# Altium project PowerMeter.PrjPcb
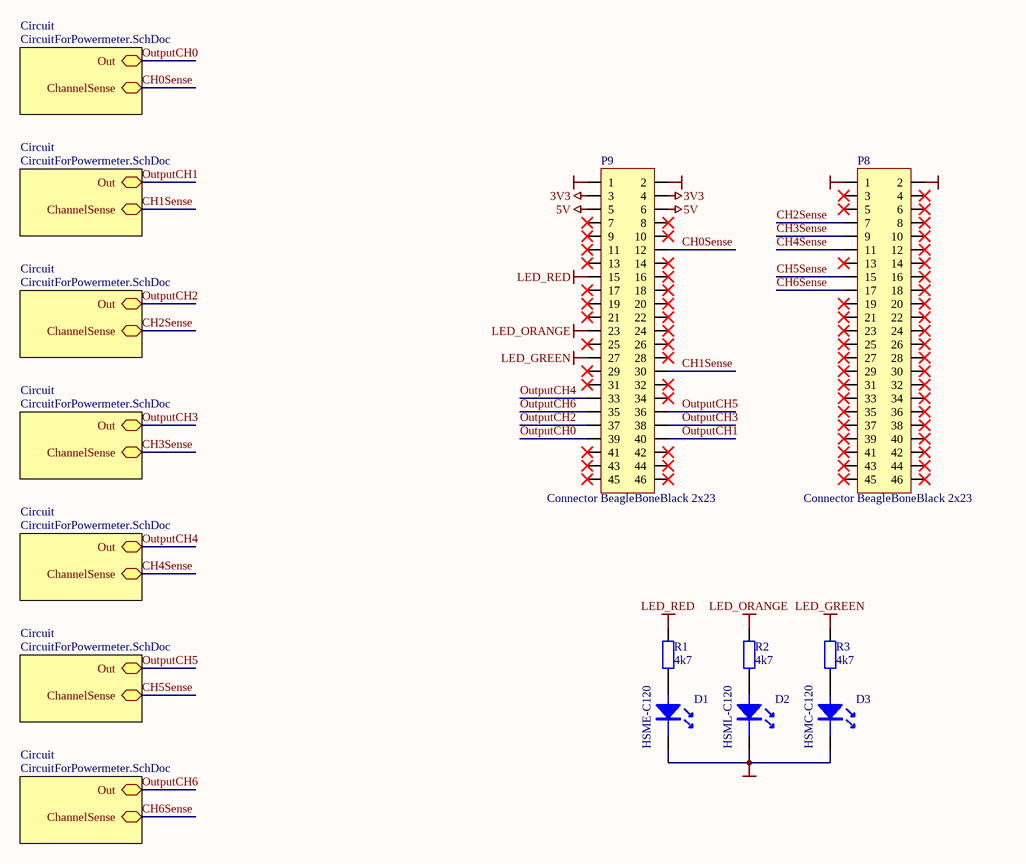
[diagram p0: BeagleBoneBlackPowerMeterCap.SchDoc]
2 sheets, 113 parts. Net scope: hierarchical (ports join the sheet entries above them; power ports are global).
Board file: PowerMeterCap.PcbDoc
Sheets:
  BeagleBoneBlackPowerMeterCap.SchDoc
    Circuit = CircuitForPowermeter.SchDoc
    Circuit = CircuitForPowermeter.SchDoc
    Circuit = CircuitForPowermeter.SchDoc
    Circuit = CircuitForPowermeter.SchDoc
    Circuit = CircuitForPowermeter.SchDoc
    Circuit = CircuitForPowermeter.SchDoc
    Circuit = CircuitForPowermeter.SchDoc

## Sheet BeagleBoneBlackPowerMeterCap.SchDoc: PowerMeterCapForBeagleBone
size A4; Date: 22.06.2020; CompanyName: -; DrawnBy: Baris; DocumentNumber: 69; Revision: 1.1; SheetNumber: 1; SheetTotal: 1; CurrentTime: 22.06.2020

### Parts
D1  HSME-C120  [AVAGO_HSMx-C120]
D2  HSML-C120  [AVAGO_HSMx-C120]
D3  HSMC-C120  [AVAGO_HSMx-C120]
P8  Connector BeagleBoneBlack 2x23  [Connector_BeagleBoneBlack_2x23]
P9  Connector BeagleBoneBlack 2x23  [Connector_BeagleBoneBlack_2x23]
R1  4k7  [0805_R]
R2  4k7  [0805_R]
R3  4k7  [0805_R]

### Sub-sheets
Circuit = CircuitForPowermeter.SchDoc: Out, ChannelSense
Circuit = CircuitForPowermeter.SchDoc: Out, ChannelSense
Circuit = CircuitForPowermeter.SchDoc: Out, ChannelSense
Circuit = CircuitForPowermeter.SchDoc: Out, ChannelSense
Circuit = CircuitForPowermeter.SchDoc: Out, ChannelSense
Circuit = CircuitForPowermeter.SchDoc: Out, ChannelSense
Circuit = CircuitForPowermeter.SchDoc: Out, ChannelSense

### Nets
3V3: P9.3 P9.4
5V: P9.5 P9.6
LED_GREEN: P9.27 R3.2
LED_ORANGE: P9.23 R2.2
LED_RED: P9.15 R1.2
NetC1_Circuit#1_2: D1.C D2.C D3.C P8.1 P8.2 P9.1 P9.2
CH0Sense: P9.12 ; sheet Circuit/ChannelSense
CH1Sense: P9.30 ; sheet Circuit/ChannelSense
CH2Sense: P8.7 ; sheet Circuit/ChannelSense
CH3Sense: P8.9 ; sheet Circuit/ChannelSense
CH4Sense: P8.11 ; sheet Circuit/ChannelSense
CH5Sense: P8.15 ; sheet Circuit/ChannelSense
CH6Sense: P8.17 ; sheet Circuit/ChannelSense
OutputCH0: P9.39 ; sheet Circuit/Out
OutputCH1: P9.40 ; sheet Circuit/Out
OutputCH2: P9.37 ; sheet Circuit/Out
OutputCH3: P9.38 ; sheet Circuit/Out
OutputCH4: P9.33 ; sheet Circuit/Out
OutputCH5: P9.36 ; sheet Circuit/Out
OutputCH6: P9.35 ; sheet Circuit/Out
NetD1_A: D1.A R1.1
NetD2_A: D2.A R2.1
NetD3_A: D3.A R3.1

Not connected (* = marked no-connect by the designer): P8 3* 4* 5* 6* 8* 10* 12* 13* 14* 16* 18* 19* 20* 21* 22* 23* 24* 25* 26* 27* 28* 29* 30* 31* 32* 33* 34* 35* 36* 37* 38* 39* 40* 41* 42* 43* 44* 45* 46*; P9 7* 8* 9* 10* 11* 13* 14* 16* 17* 18* 19* 20* 21* 22* 24* 25* 26* 28* 29* 31* 32* 34* 41* 42* 43* 44* 45* 46*

### Notes on the sheet
- Title:
- Number:
- Drawn by:
- Revision:
- Date:
- Sheet
- of
- File:

### Library data of the parts
D1 = HSME-C120: LED right angle green; Hersteller: BROADCOM; Art-Nummer: P300 326; Bestell-Bezeichnung: HSME-C120
D2 = HSML-C120: LED right angle orange; Hersteller: BROADCOM; Art-Nummer: P300 325; Bestell-Bezeichnung: HSML-C120
D3 = HSMC-C120: LED right angle red; Hersteller: BROADCOM; Art-Nummer: P300 324; Bestell-Bezeichnung: HSMC-C120
P8 P9 = J_Connector_BeagleBoneBlack_2x23: 23pin dual row header
R1-R3 = R: Resistor; Value: 4k7; Power Rating: *; Tolerance: *; Manufacturer 1: *; Manufacturer 1 Part No.: *; Distributor 1: *; Distributor 1 Part No.: *

## Sheet CircuitForPowermeter.SchDoc: CircuitForPowerMeter
size A4; Date: 19.06.2020; DrawnBy: Baris; Organization: espros photonics AG; Address1: St. Gallerstrasse 135; Address2: 7320 Sargans; Address3: Switzerland; DocumentNumber: 69; Revision: V1.1; SheetNumber: 1; SheetTotal: 1
Used 7 times, as channels Circuit, Circuit, Circuit, Circuit, Circuit, Circuit, Circuit. Parts and nets are listed once, with the designators drawn on the sheet.
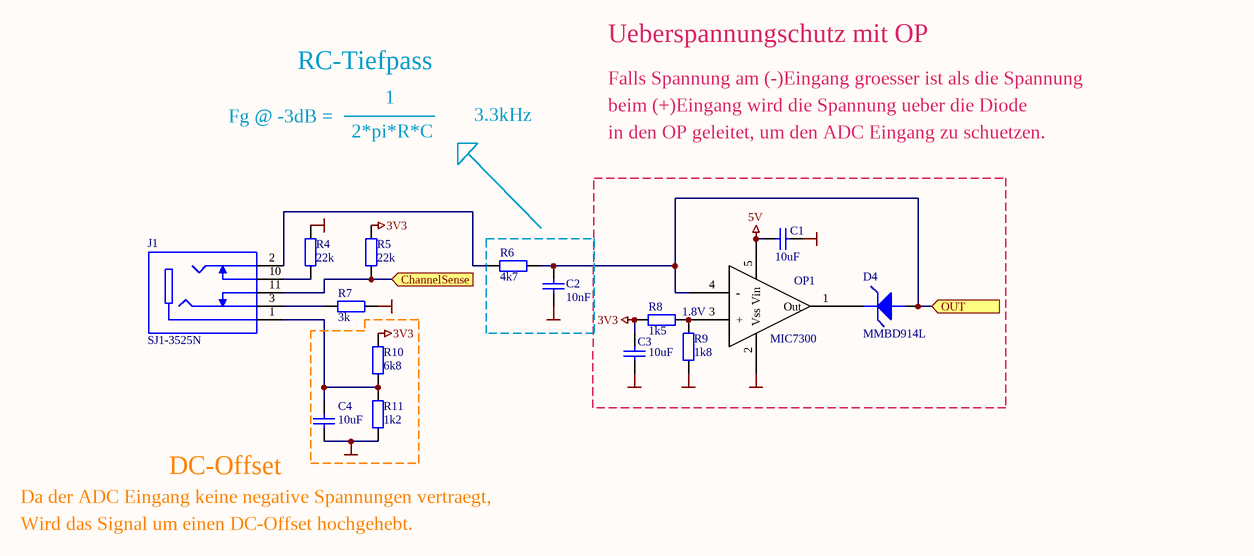
[diagram p1: CircuitForPowermeter.SchDoc]

### Parts
C1  10uF  [1206_C]
C2  10nF  [0805]
C3  10uF  [1206_C]
C4  10uF  [1206_C]
D4  MMBD914L  [SOT-23]
J1  SJ1-3525N  [CUI_SJ1-3525N]
OP1  MIC7300  [SOT-23-5]
R4  22k  [0805_R]
R5  22k  [0805_R]
R6  4k7  [0805_R]
R7  3k  [0805_R]
R8  1k5  [0805_R]
R9  1k8  [0805_R]
R10  6k8  [0805_R]
R11  1k2  [0805_R]

### Blocks framed on the sheet
1.8V: C1 C3 D4 OP1 R8 R9

### Ports
ChannelSense (in), OUT (in)

### Nets
3V3: C3.2 R5.1 R8.1 R10.2
5V: C1.1 OP1.5(Vin)
NetC1_2: C1.2 C2.1 C3.1 C4.1 OP1.2(Vss) R4.1 R7.1 R9.1 R11.1
ChannelSense: J1.11 R5.2 ; port ChannelSense
OUT: C2.2 D4.1(A) OP1.4(-) R6.2 ; port OUT
NetC4_2: C4.2 J1.1 R10.1 R11.2
NetD4_3: D4.3(K) OP1.1(Out)
NetJ1_2: J1.2 R6.1
NetJ1_3: J1.3 R7.2
NetJ1_10: J1.10 R4.2
NetOP1_3: OP1.3(+) R8.2 R9.2

Not connected (* = marked no-connect by the designer): D4 2(NC)

### Channels
Circuit: designators end in _Circuit#1; ports ChannelSense=CH0Sense OUT=OutputCH0
Circuit: designators end in _Circuit#2; ports ChannelSense=CH1Sense OUT=OutputCH1
Circuit: designators end in _Circuit#3; ports ChannelSense=CH2Sense OUT=OutputCH2
Circuit: designators end in _Circuit#4; ports ChannelSense=CH3Sense OUT=OutputCH3
Circuit: designators end in _Circuit#5; ports ChannelSense=CH4Sense OUT=OutputCH4
Circuit: designators end in _Circuit#6; ports ChannelSense=CH5Sense OUT=OutputCH5
Circuit: designators end in _Circuit#7; ports ChannelSense=CH6Sense OUT=OutputCH6

### Notes on the sheet
- RC-Tiefpass
- Ueberspannungschutz mit OP
- Falls Spannung am (-)Eingang groesser ist als die Spannung
- Fg @ -3dB =
- 2*pi*R*C
- 1
- 3.3kHz
- beim (+)Eingang wird die Spannung ueber die Diode
- in den OP geleitet, um den ADC Eingang zu schuetzen.
- (near C4) DC-Offset
- Da der ADC Eingang keine negative Spannungen vertraegt,
- Wird das Signal um einen DC-Offset hochgehebt.
- Title:
- Number:
- Drawn by:
- Revision:
- Date:
- Sheet
- of
- File:

### Library data of the parts
C1-C4 = C: Capacitor; Tolerance: *; Voltage Rating: *; Ceramic: *; Manufacturer 1: *; Manufacturer 1 Part No.: *; Distributor 1: *; Distributor 1 Part No.: *
  C1 C3 C4: Value: 10uF
  C2: Value: 10nF
D4 = BZX84-B10: High-Speed Switching  Diode; Art-Nummer: No; Hersteller: MMBD914L; Bestell-Bezeichnung: MMBD914L
J1 = SJ1-3525N: 3.5 mm, Stereo, Right Angle, Through Hole, Audio Jack Connector; MF: CUI Devices; Package: None; Price: None; Availability: Unavailable; MP: SJ1-3525N; CUI_purchase_URL: https://www.cuidevices.com/product/interconnect/connectors/audio-connectors/jacks/sj1-352xn-series?utm_source=snapeda.com&utm_medium=referral&utm_campaign=snapedaBOM; SnapEDA_Link: https://www.snapeda.com/parts/SJ1-3525N/CUI%20Devices/view-part/231506/?ref=snap; Value: *
OP1 = Component_1
R4 R5 = R: Resistor; Value: 15k; Power Rating: *; Tolerance: *; Manufacturer 1: *; Manufacturer 1 Part No.: *; Distributor 1: *; Distributor 1 Part No.: *
R6-R11 = R: Resistor; Power Rating: *; Tolerance: *; Manufacturer 1: *; Manufacturer 1 Part No.: *; Distributor 1: *; Distributor 1 Part No.: *
  R6: Value: 4k7
  R7: Value: 3k
  R8: Value: 1k5
  R9: Value: 1k8
  R10: Value: 6k8
  R11: Value: 1k2

## Nets that join several sheets
3V3: BeagleBoneBlackPowerMeterCap (P9.3 P9.4), Circuit (C3_Circuit#1.2 R5_Circuit#1.1 R8_Circuit#1.1 R10_Circuit#1.2), Circuit (C3_Circuit#2.2 R5_Circuit#2.1 R8_Circuit#2.1 R10_Circuit#2.2), Circuit (C3_Circuit#3.2 R5_Circuit#3.1 R8_Circuit#3.1 R10_Circuit#3.2), Circuit (C3_Circuit#4.2 R5_Circuit#4.1 R8_Circuit#4.1 R10_Circuit#4.2), Circuit (C3_Circuit#5.2 R5_Circuit#5.1 R8_Circuit#5.1 R10_Circuit#5.2), Circuit (C3_Circuit#6.2 R5_Circuit#6.1 R8_Circuit#6.1 R10_Circuit#6.2), Circuit (C3_Circuit#7.2 R5_Circuit#7.1 R8_Circuit#7.1 R10_Circuit#7.2)
5V: BeagleBoneBlackPowerMeterCap (P9.5 P9.6), Circuit (C1_Circuit#1.1 OP1_Circuit#1.5), Circuit (C1_Circuit#2.1 OP1_Circuit#2.5), Circuit (C1_Circuit#3.1 OP1_Circuit#3.5), Circuit (C1_Circuit#4.1 OP1_Circuit#4.5), Circuit (C1_Circuit#5.1 OP1_Circuit#5.5), Circuit (C1_Circuit#6.1 OP1_Circuit#6.5), Circuit (C1_Circuit#7.1 OP1_Circuit#7.5)
NetC1_Circuit#1_2: BeagleBoneBlackPowerMeterCap (7 pins), Circuit (9 pins), Circuit (9 pins), Circuit (9 pins), Circuit (9 pins), Circuit (9 pins), Circuit (9 pins), Circuit (9 pins)
CH0Sense: BeagleBoneBlackPowerMeterCap (P9.12), Circuit (J1_Circuit#1.11 R5_Circuit#1.2)
CH1Sense: BeagleBoneBlackPowerMeterCap (P9.30), Circuit (J1_Circuit#2.11 R5_Circuit#2.2)
CH2Sense: BeagleBoneBlackPowerMeterCap (P8.7), Circuit (J1_Circuit#3.11 R5_Circuit#3.2)
CH3Sense: BeagleBoneBlackPowerMeterCap (P8.9), Circuit (J1_Circuit#4.11 R5_Circuit#4.2)
CH4Sense: BeagleBoneBlackPowerMeterCap (P8.11), Circuit (J1_Circuit#5.11 R5_Circuit#5.2)
CH5Sense: BeagleBoneBlackPowerMeterCap (P8.15), Circuit (J1_Circuit#6.11 R5_Circuit#6.2)
CH6Sense: BeagleBoneBlackPowerMeterCap (P8.17), Circuit (J1_Circuit#7.11 R5_Circuit#7.2)
OutputCH0: BeagleBoneBlackPowerMeterCap (P9.39), Circuit (C2_Circuit#1.2 D4_Circuit#1.1 OP1_Circuit#1.4 R6_Circuit#1.2)
OutputCH1: BeagleBoneBlackPowerMeterCap (P9.40), Circuit (C2_Circuit#2.2 D4_Circuit#2.1 OP1_Circuit#2.4 R6_Circuit#2.2)
OutputCH2: BeagleBoneBlackPowerMeterCap (P9.37), Circuit (C2_Circuit#3.2 D4_Circuit#3.1 OP1_Circuit#3.4 R6_Circuit#3.2)
OutputCH3: BeagleBoneBlackPowerMeterCap (P9.38), Circuit (C2_Circuit#4.2 D4_Circuit#4.1 OP1_Circuit#4.4 R6_Circuit#4.2)
OutputCH4: BeagleBoneBlackPowerMeterCap (P9.33), Circuit (C2_Circuit#5.2 D4_Circuit#5.1 OP1_Circuit#5.4 R6_Circuit#5.2)
OutputCH5: BeagleBoneBlackPowerMeterCap (P9.36), Circuit (C2_Circuit#6.2 D4_Circuit#6.1 OP1_Circuit#6.4 R6_Circuit#6.2)
OutputCH6: BeagleBoneBlackPowerMeterCap (P9.35), Circuit (C2_Circuit#7.2 D4_Circuit#7.1 OP1_Circuit#7.4 R6_Circuit#7.2)